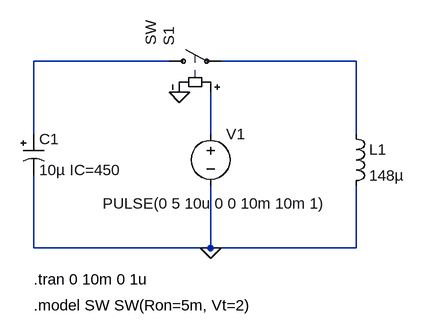
[diagram p0: schematic Coilgun-1V04-resonance.asc]
Coilgun-1V04-resonance.asc, the LTspice schematic file:
Version 4
SHEET 1 880 680
WIRE -560 -144 -768 -144
WIRE -272 -144 -480 -144
WIRE -768 -32 -768 -144
WIRE -496 -32 -496 -96
WIRE -272 -32 -272 -144
WIRE -768 144 -768 32
WIRE -496 144 -496 48
WIRE -496 144 -768 144
WIRE -272 144 -272 48
WIRE -272 144 -496 144
FLAG -496 144 0
FLAG -544 -96 0
SYMBOL polcap -784 -32 R0
WINDOW 3 24 56 Left 2
SYMATTR Value 10µ IC=450
SYMATTR InstName C1
SYMATTR SpiceLine V=63 Irms=900m Rser=10m Lser=0
SYMATTR Description Capacitor
SYMATTR Type cap
SYMBOL ind -288 -48 R0
SYMATTR InstName L1
SYMATTR Value 148µ
SYMATTR SpiceLine Rser=10m
SYMBOL sw -576 -144 R270
WINDOW 3 24 -12 Left 2
WINDOW 38 24 -12 Left 2
SYMATTR Value ""
SYMATTR SpiceModel SW
SYMATTR InstName S1
SYMBOL voltage -496 -48 R0
WINDOW 3 -166 123 Left 2
WINDOW 123 0 0 Left 2
WINDOW 39 0 0 Left 2
SYMATTR Value PULSE(0 5 10u 0 0 10m 10m 1)
SYMATTR InstName V1
TEXT -768 192 Left 2 !.tran 0 10m 0 1u
TEXT -768 232 Left 2 !.model SW SW(Ron=5m, Vt=2)

The netlist it stands for:
* Coilgun-1V04-resonance.asc
C1 N001 0 10µ IC=450 V=63 Irms=900m Rser=10m Lser=0
L1 N002 0 148µ Rser=10m
S1 N001 N002 N003 0 SW
V1 N003 0 PULSE(0 5 10u 0 0 10m 10m 1)
.tran 0 10m 0 1u
.model SW SW(Ron=5m, Vt=2)
.backanno
.end